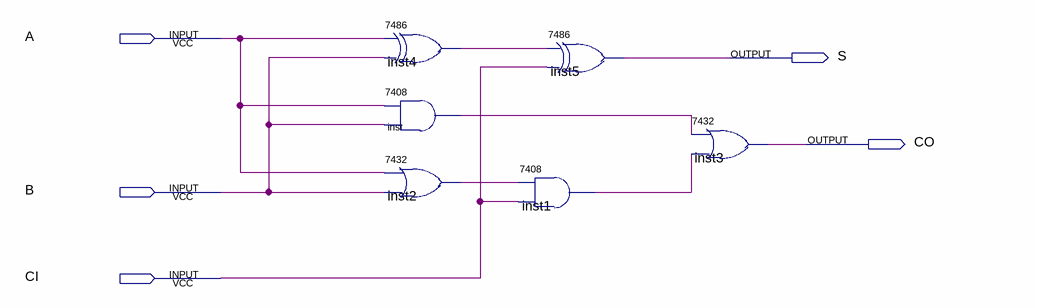
[diagram p0: schematic sheet]
// Quartus schematic SomadorCompleto.bdf as structural Verilog: 6 symbols, 5 pins
module SomadorCompleto (
  input  A,
  input  B,
  input  CI,
  output S,
  output CO
);

  wire inst1_1, inst2_1, inst4_1, inst_1;

  \7486  inst4 (.\2 (A), .\3 (B), .\1 (inst4_1));
  \7408  inst (.\3 (B), .\2 (A), .\1 (inst_1));
  \7432  inst2 (.\2 (A), .\3 (B), .\1 (inst2_1));
  \7486  inst5 (.\2 (inst4_1), .\3 (CI), .\1 (S));
  \7408  inst1 (.\3 (CI), .\2 (inst2_1), .\1 (inst1_1));
  \7432  inst3 (.\2 (inst_1), .\3 (inst1_1), .\1 (CO));
endmodule
